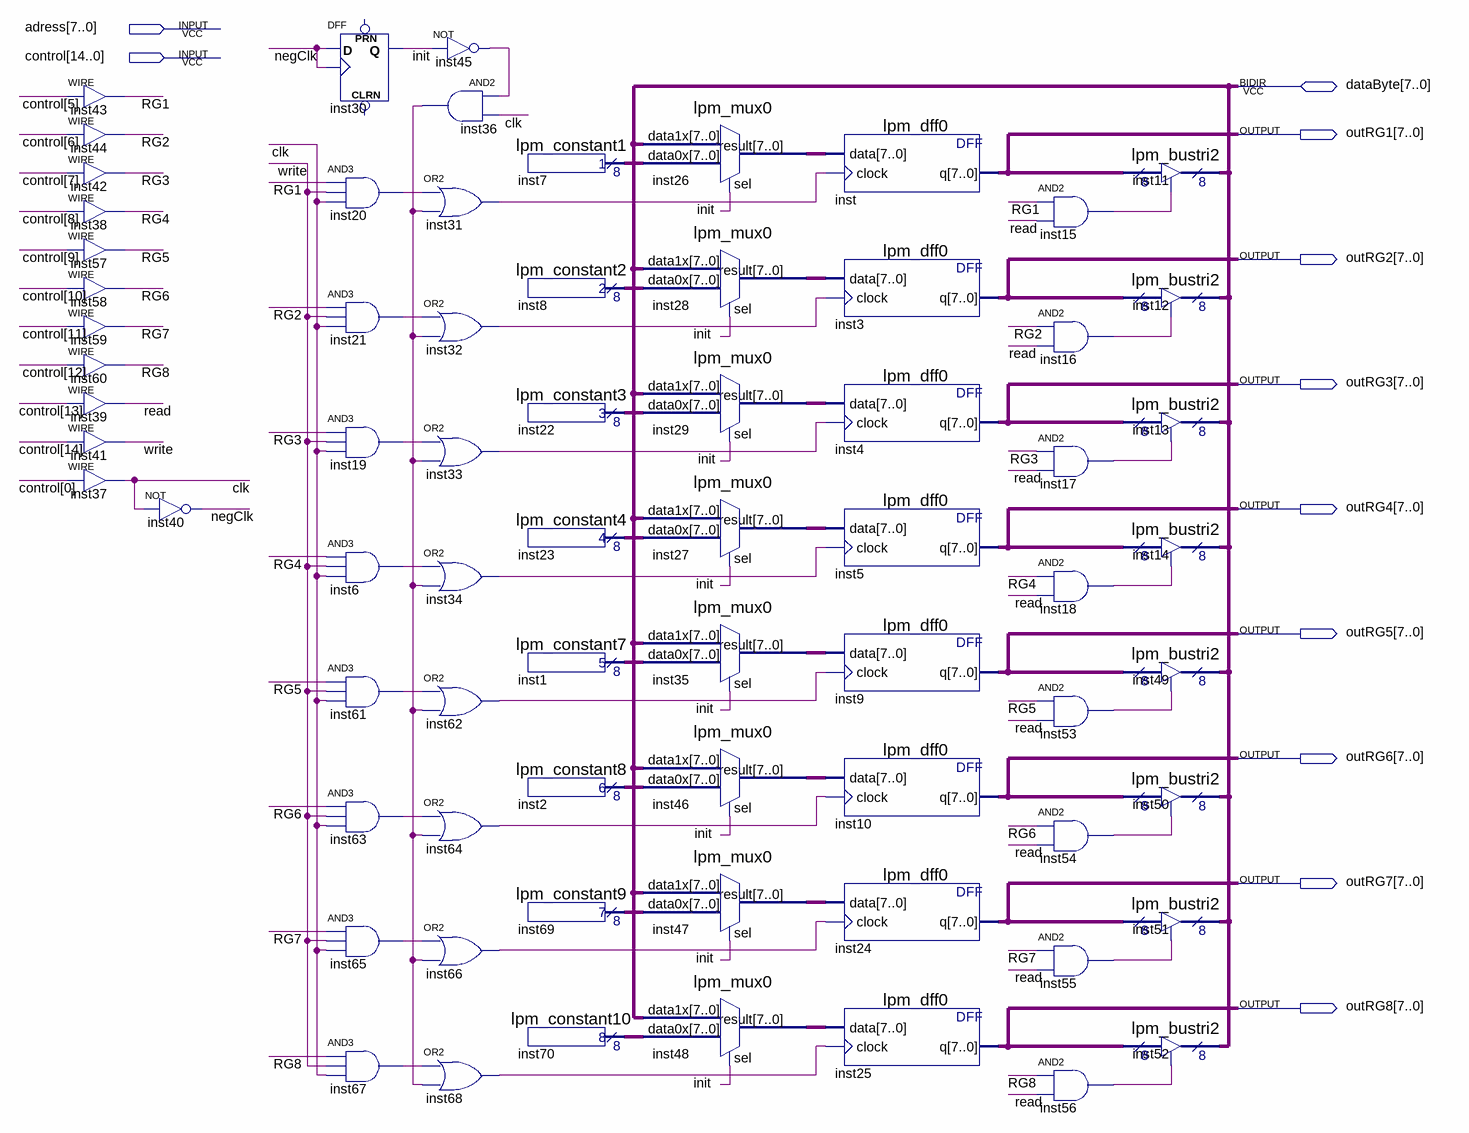
[diagram p0: schematic sheet]
// Quartus schematic Poh.bdf as structural Verilog: 71 symbols, 11 pins
module Poh (
  input  [7:0] adress,
  input  [14:0] control,
  inout  [7:0] dataByte,
  output [7:0] outRG1,
  output [7:0] outRG2,
  output [7:0] outRG3,
  output [7:0] outRG4,
  output [7:0] outRG5,
  output [7:0] outRG6,
  output [7:0] outRG7,
  output [7:0] outRG8
);

  wire clk, init, inst6_out, inst15_out, inst16_out, inst17_out, inst18_out, inst19_out, inst20_out,
       inst21_out, inst31_out, inst32_out, inst33_out, inst34_out, inst36_out, inst45_out, inst53_out,
       inst54_out, inst55_out, inst56_out, inst61_out, inst62_out, inst63_out, inst64_out, inst65_out,
       inst66_out, inst67_out, inst68_out, negClk, read, RG1, RG2, RG3, RG4, RG5, RG6, RG7, RG8, write;
  wire [7:0] inst1_result, inst2_result, inst7_result, inst8_result, inst22_result, inst23_result,
       inst26_result, inst27_result, inst28_result, inst29_result, inst35_result, inst46_result,
       inst47_result, inst48_result, inst69_result, inst70_result;

  assign RG1 = control[5];  // WIRE inst43
  assign RG2 = control[6];  // WIRE inst44
  assign RG3 = control[7];  // WIRE inst42
  assign RG4 = control[8];  // WIRE inst38
  assign RG5 = control[9];  // WIRE inst57
  assign RG6 = control[10];  // WIRE inst58
  assign RG7 = control[11];  // WIRE inst59
  assign RG8 = control[12];  // WIRE inst60
  assign read = control[13];  // WIRE inst39
  assign write = control[14];  // WIRE inst41
  assign clk = control[0];  // WIRE inst37
  not inst40 (negClk, clk);
  DFF inst30 (.CLK(negClk), .D(negClk), .Q(init));  // open: CLRN, PRN
  and inst20 (inst20_out, RG1, write, clk);
  and inst21 (inst21_out, RG2, write, clk);
  and inst19 (inst19_out, RG3, write, clk);
  and inst6 (inst6_out, RG4, write, clk);
  and inst61 (inst61_out, RG5, write, clk);
  and inst63 (inst63_out, RG6, write, clk);
  and inst65 (inst65_out, RG7, write, clk);
  and inst67 (inst67_out, RG8, write, clk);
  not inst45 (inst45_out, init);
  and inst36 (inst36_out, inst45_out, clk);
  or inst31 (inst31_out, inst20_out, inst36_out);
  or inst32 (inst32_out, inst21_out, inst36_out);
  or inst33 (inst33_out, inst19_out, inst36_out);
  or inst34 (inst34_out, inst6_out, inst36_out);
  or inst62 (inst62_out, inst61_out, inst36_out);
  or inst64 (inst64_out, inst63_out, inst36_out);
  or inst66 (inst66_out, inst65_out, inst36_out);
  or inst68 (inst68_out, inst67_out, inst36_out);
  lpm_constant1 inst7 (.result(inst7_result));
  lpm_constant2 inst8 (.result(inst8_result));
  lpm_constant3 inst22 (.result(inst22_result));
  lpm_constant4 inst23 (.result(inst23_result));
  lpm_constant7 inst1 (.result(inst1_result));
  lpm_constant8 inst2 (.result(inst2_result));
  lpm_constant9 inst69 (.result(inst69_result));
  lpm_constant10 inst70 (.result(inst70_result));
  lpm_mux0 inst26 (.data1x(dataByte), .data0x(inst7_result), .sel(init), .result(inst26_result));
  lpm_mux0 inst28 (.data1x(dataByte), .data0x(inst8_result), .sel(init), .result(inst28_result));
  lpm_mux0 inst29 (.data1x(dataByte), .data0x(inst22_result), .sel(init), .result(inst29_result));
  lpm_mux0 inst27 (.data1x(dataByte), .data0x(inst23_result), .sel(init), .result(inst27_result));
  lpm_mux0 inst35 (.data1x(dataByte), .data0x(inst1_result), .sel(init), .result(inst35_result));
  lpm_mux0 inst46 (.data1x(dataByte), .data0x(inst2_result), .sel(init), .result(inst46_result));
  lpm_mux0 inst47 (.data1x(dataByte), .data0x(inst69_result), .sel(init), .result(inst47_result));
  lpm_mux0 inst48 (.data1x(dataByte), .data0x(inst70_result), .sel(init), .result(inst48_result));
  lpm_dff0 inst (.data(inst26_result), .clock(inst31_out), .q(outRG1));
  lpm_dff0 inst3 (.data(inst28_result), .clock(inst32_out), .q(outRG2));
  lpm_dff0 inst4 (.data(inst29_result), .clock(inst33_out), .q(outRG3));
  lpm_dff0 inst5 (.data(inst27_result), .clock(inst34_out), .q(outRG4));
  lpm_dff0 inst9 (.data(inst35_result), .clock(inst62_out), .q(outRG5));
  lpm_dff0 inst10 (.data(inst46_result), .clock(inst64_out), .q(outRG6));
  lpm_dff0 inst24 (.data(inst47_result), .clock(inst66_out), .q(outRG7));
  lpm_dff0 inst25 (.data(inst48_result), .clock(inst68_out), .q(outRG8));
  and inst15 (inst15_out, RG1, read);
  and inst16 (inst16_out, RG2, read);
  and inst17 (inst17_out, RG3, read);
  and inst18 (inst18_out, RG4, read);
  and inst53 (inst53_out, RG5, read);
  and inst54 (inst54_out, RG6, read);
  and inst55 (inst55_out, RG7, read);
  and inst56 (inst56_out, RG8, read);
  lpm_bustri2 inst11 (.enabledt(inst15_out), .data(outRG1), .tridata(dataByte));
  lpm_bustri2 inst12 (.enabledt(inst16_out), .data(outRG2), .tridata(dataByte));
  lpm_bustri2 inst13 (.enabledt(inst17_out), .data(outRG3), .tridata(dataByte));
  lpm_bustri2 inst14 (.enabledt(inst18_out), .data(outRG4), .tridata(dataByte));
  lpm_bustri2 inst49 (.enabledt(inst53_out), .data(outRG5), .tridata(dataByte));
  lpm_bustri2 inst50 (.enabledt(inst54_out), .data(outRG6), .tridata(dataByte));
  lpm_bustri2 inst51 (.enabledt(inst55_out), .data(outRG7), .tridata(dataByte));
  lpm_bustri2 inst52 (.enabledt(inst56_out), .data(outRG8), .tridata(dataByte));
endmodule
